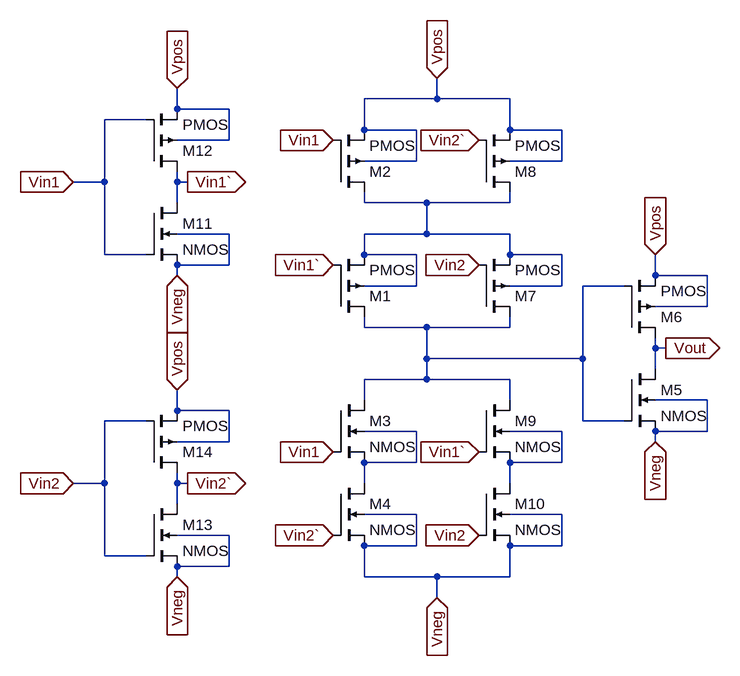
[diagram p0: schematic XOR_SYM.asc]
XOR_SYM.asc, the LTspice schematic file:
Version 4
SHEET 1 880 772
WIRE 144 -144 144 -176
WIRE 144 -144 32 -144
WIRE 256 -144 144 -144
WIRE -256 -128 -256 -160
WIRE -176 -128 -256 -128
WIRE -304 -112 -368 -112
WIRE 32 -96 32 -144
WIRE 112 -96 32 -96
WIRE 256 -96 256 -144
WIRE 336 -96 256 -96
WIRE -176 -80 -176 -128
WIRE -176 -80 -256 -80
WIRE 112 -48 112 -96
WIRE 112 -48 32 -48
WIRE 336 -48 336 -96
WIRE 336 -48 256 -48
WIRE -368 -16 -368 -112
WIRE -368 -16 -416 -16
WIRE -256 -16 -256 -32
WIRE -240 -16 -256 -16
WIRE -256 16 -256 -16
WIRE 32 16 32 0
WIRE 128 16 32 16
WIRE 256 16 256 0
WIRE 256 16 128 16
WIRE -176 64 -256 64
WIRE 128 64 128 16
WIRE 128 64 32 64
WIRE 256 64 128 64
WIRE -368 96 -368 -16
WIRE -304 96 -368 96
WIRE 32 96 32 64
WIRE 112 96 32 96
WIRE 256 96 256 64
WIRE 336 96 256 96
WIRE -176 112 -176 64
WIRE -176 112 -256 112
WIRE -256 128 -256 112
WIRE 480 128 480 96
WIRE 560 128 480 128
WIRE 112 144 112 96
WIRE 112 144 32 144
WIRE 336 144 336 96
WIRE 336 144 256 144
WIRE 432 144 368 144
WIRE 560 176 560 128
WIRE 560 176 480 176
WIRE 32 208 32 192
WIRE 128 208 32 208
WIRE 256 208 256 192
WIRE 256 208 128 208
WIRE 480 240 480 224
WIRE 496 240 480 240
WIRE 128 256 128 208
WIRE 368 256 368 144
WIRE 368 256 128 256
WIRE 480 272 480 240
WIRE 128 288 128 256
WIRE 128 288 32 288
WIRE 256 288 128 288
WIRE 32 320 32 288
WIRE 256 320 256 288
WIRE 560 320 480 320
WIRE -256 336 -256 304
WIRE -176 336 -256 336
WIRE -304 352 -368 352
WIRE 368 352 368 256
WIRE 432 352 368 352
WIRE 112 368 32 368
WIRE 336 368 256 368
WIRE 560 368 560 320
WIRE 560 368 480 368
WIRE -176 384 -176 336
WIRE -176 384 -256 384
WIRE 480 384 480 368
WIRE 112 416 112 368
WIRE 112 416 32 416
WIRE 336 416 336 368
WIRE 336 416 256 416
WIRE -368 448 -368 352
WIRE -368 448 -416 448
WIRE -256 448 -256 432
WIRE -240 448 -256 448
WIRE 32 448 32 416
WIRE 256 448 256 416
WIRE -256 480 -256 448
WIRE 112 496 32 496
WIRE 336 496 256 496
WIRE -176 528 -256 528
WIRE 112 544 112 496
WIRE 112 544 32 544
WIRE 336 544 336 496
WIRE 336 544 256 544
WIRE -368 560 -368 448
WIRE -304 560 -368 560
WIRE -176 576 -176 528
WIRE -176 576 -256 576
WIRE -256 592 -256 576
WIRE 32 592 32 544
WIRE 144 592 32 592
WIRE 256 592 256 544
WIRE 256 592 144 592
WIRE 144 624 144 592
FLAG 144 -176 Vpos
IOPIN 144 -176 In
FLAG -416 -16 Vin1
IOPIN -416 -16 In
FLAG -16 400 Vin1
IOPIN -16 400 In
FLAG -416 448 Vin2
IOPIN -416 448 In
FLAG 144 624 Vneg
IOPIN 144 624 In
FLAG 480 96 Vpos
IOPIN 480 96 In
FLAG 480 384 Vneg
IOPIN 480 384 In
FLAG 496 240 Vout
IOPIN 496 240 Out
FLAG -16 -80 Vin1
IOPIN -16 -80 In
FLAG -256 -160 Vpos
IOPIN -256 -160 In
FLAG -256 128 Vneg
IOPIN -256 128 In
FLAG -240 -16 Vin1`
IOPIN -240 -16 Out
FLAG -256 304 Vpos
IOPIN -256 304 In
FLAG -256 592 Vneg
IOPIN -256 592 In
FLAG -240 448 Vin2`
IOPIN -240 448 Out
FLAG 208 112 Vin2
IOPIN 208 112 In
FLAG 208 -80 Vin2`
IOPIN 208 -80 In
FLAG -16 112 Vin1`
IOPIN -16 112 In
FLAG 208 400 Vin1`
IOPIN 208 400 In
FLAG -16 528 Vin2`
IOPIN -16 528 In
FLAG 208 528 Vin2
IOPIN 208 528 In
SYMBOL pmos4 -16 192 M180
SYMATTR InstName M1
SYMBOL pmos4 -16 0 M180
SYMATTR InstName M2
SYMBOL nmos4 -16 320 R0
SYMATTR InstName M3
SYMBOL nmos4 -16 448 R0
SYMATTR InstName M4
SYMBOL nmos4 432 272 R0
SYMATTR InstName M5
SYMBOL pmos4 432 224 M180
SYMATTR InstName M6
SYMBOL pmos4 208 192 M180
SYMATTR InstName M7
SYMBOL pmos4 208 0 M180
SYMATTR InstName M8
SYMBOL nmos4 208 320 R0
SYMATTR InstName M9
SYMBOL nmos4 208 448 R0
SYMATTR InstName M10
SYMBOL nmos4 -304 16 R0
SYMATTR InstName M11
SYMBOL pmos4 -304 -32 M180
SYMATTR InstName M12
SYMBOL nmos4 -304 480 R0
SYMATTR InstName M13
SYMBOL pmos4 -304 432 M180
SYMATTR InstName M14

The netlist it stands for:
* XOR_SYM.asc
M1 N002 Vin1` N001 N001 PMOS
M2 N001 Vin1 Vpos Vpos PMOS
M3 N002 Vin1 N003 N003 NMOS
M4 N003 Vin2` Vneg Vneg NMOS
M5 Vout N002 Vneg Vneg NMOS
M6 Vout N002 Vpos Vpos PMOS
M7 N002 Vin2 N001 N001 PMOS
M8 N001 Vin2` Vpos Vpos PMOS
M9 N002 Vin1` N004 N004 NMOS
M10 N004 Vin2 Vneg Vneg NMOS
M11 Vin1` Vin1 Vneg Vneg NMOS
M12 Vin1` Vin1 Vpos Vpos PMOS
M13 Vin2` Vin2 Vneg Vneg NMOS
M14 Vin2` Vin2 Vpos Vpos PMOS
.model NMOS NMOS
.model PMOS PMOS
.lib standard.mos
.backanno
.end